# EAGLE design mainboard (EAGLE 6.5.0)
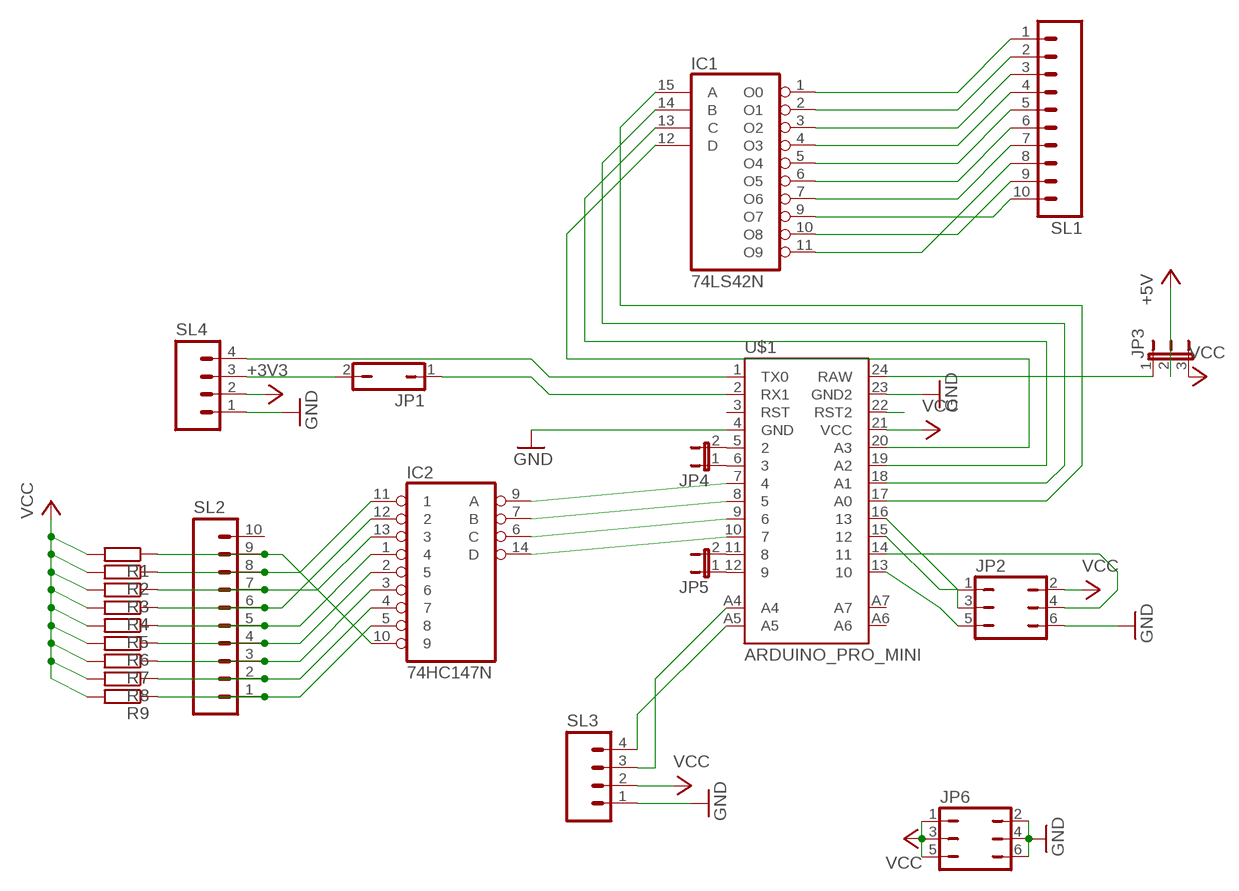
[diagram p0: schematic, sheet 1]

## Parts
IC1  74LS42N  [DIL16]
IC2  74HC147N  [DIL16]
JP1  JP1Q  [JP1]
JP2  JP3Q  [JP3Q]
JP3  JP2E  [JP2]
JP4  JP1E  [JP1]
JP5  JP1E  [JP1]
JP6  JP3Q  [JP3Q]
R1  R-EU_0204/7  [0204/7]
R2  R-EU_0204/7  [0204/7]
R3  R-EU_0204/7  [0204/7]
R4  R-EU_0204/7  [0204/7]
R5  R-EU_0204/7  [0204/7]
R6  R-EU_0204/7  [0204/7]
R7  R-EU_0204/7  [0204/7]
R8  R-EU_0204/7  [0204/7]
R9  R-EU_0204/7  [0204/7]
SL1  M10  [10P]
SL2  M10  [10P]
SL3  M04  [04P]
SL4  M04  [04P]
U$1  ARDUINO_PRO_MINI  [ARDUINO_PRO_MINI]

## Nets
+3V3: SL4.2
+5V: JP3.2
GND [Ground]: JP2.6 JP6.2 JP6.4 JP6.6 SL3.1 SL4.1 U$1.4(GND) U$1.23(GND2)
N$1: IC2.2 R6.1 SL2.4
N$2: IC2.1 R5.1 SL2.5
N$3: IC2.12 R4.1 SL2.6
N$4: IC2.5 R9.1 SL2.1
N$5: IC2.4 R8.1 SL2.2
N$6: IC2.3 R7.1 SL2.3
N$7: IC2.13 R3.1 SL2.7
N$8: IC2.11 R2.1 SL2.8
N$9: IC2.10 R1.1 SL2.9
N$10: IC1.15(A) U$1.17(A0)
N$11: IC1.14(B) U$1.18(A1)
N$12: IC1.13(C) U$1.19(A2)
N$13: IC1.12(D) U$1.20(A3)
N$14: IC1.9(O7) SL1.10
N$15: IC1.10(O8) SL1.9
N$16: IC1.11(O9) SL1.8
N$17: IC2.9(A) U$1.7
N$18: IC1.1(O0) SL1.1
N$19: IC1.2(O1) SL1.2
N$20: IC1.3(O2) SL1.3
N$21: IC1.4(O3) SL1.4
N$22: IC1.5(O4) SL1.5
N$23: IC1.6(O5) SL1.6
N$24: IC1.7(O6) SL1.7
N$25: IC2.7(B) U$1.8
N$26: IC2.6(C) U$1.9
N$27: IC2.14(D) U$1.10
N$28: SL3.4 U$1.A5
N$29: SL3.3 U$1.A4
N$30: SL4.4 U$1.1(TX0)
N$31: JP1.2 SL4.3
N$32: JP1.1 U$1.2(RX1)
N$33: JP2.1 U$1.15
N$34: JP2.3 U$1.16
N$35: JP2.5 U$1.13
N$36: JP2.4 U$1.14
N$41: JP3.1 U$1.24(RAW)
N$42: JP4.1 U$1.6
N$43: JP4.2 U$1.5
N$44: JP5.1 U$1.12
N$45: JP5.2 U$1.11
N$46: U$1.22(RST2)
VCC [Ground]: JP2.2 JP3.3 JP6.1 JP6.3 JP6.5 R1.2 R2.2 R3.2 R4.2 R5.2 R6.2 R7.2 R8.2 R9.2 SL3.2 U$1.21(VCC)
Unconnected: SL2.10 U$1.3(RST) U$1.A6 U$1.A7

## Power pins joined to a net without a drawn wire
GND: IC1.8(GND) IC2.8(GND)
VCC: IC1.16(VCC) IC2.16(VCC)

## Library data of the parts
IC1 = 74xx-eu:74*42: 4-line to 10-line DECODER (1-of-10)
IC2 = 74xx-eu:74*147: 10-line to 4-line and 8-line to 3-line PRIORITY DECODER
JP1 = jumper:JP1Q: JUMPER
JP2 JP6 = jumper:JP3Q: JUMPER
JP3 = jumper:JP2E: JUMPER
JP4 JP5 = jumper:JP1E: JUMPER
R1-R9 = resistor:R-EU_: RESISTOR, European symbol
SL1 SL2 = con-amp-quick:M10: AMP QUICK CONNECTOR; OC_FARNELL: unknown; OC_NEWARK: unknown
SL3 SL4 = con-amp-quick:M04: AMP QUICK CONNECTOR; OC_FARNELL: unknown; OC_NEWARK: unknown
U$1 = SparkFun-Boards:ARDUINO_PRO_MINI

## Net classes
0 default: width 3.759 mm, clearance 0.914 mm
1 Ground: width 1.219 mm, clearance 0.914 mm

## Board
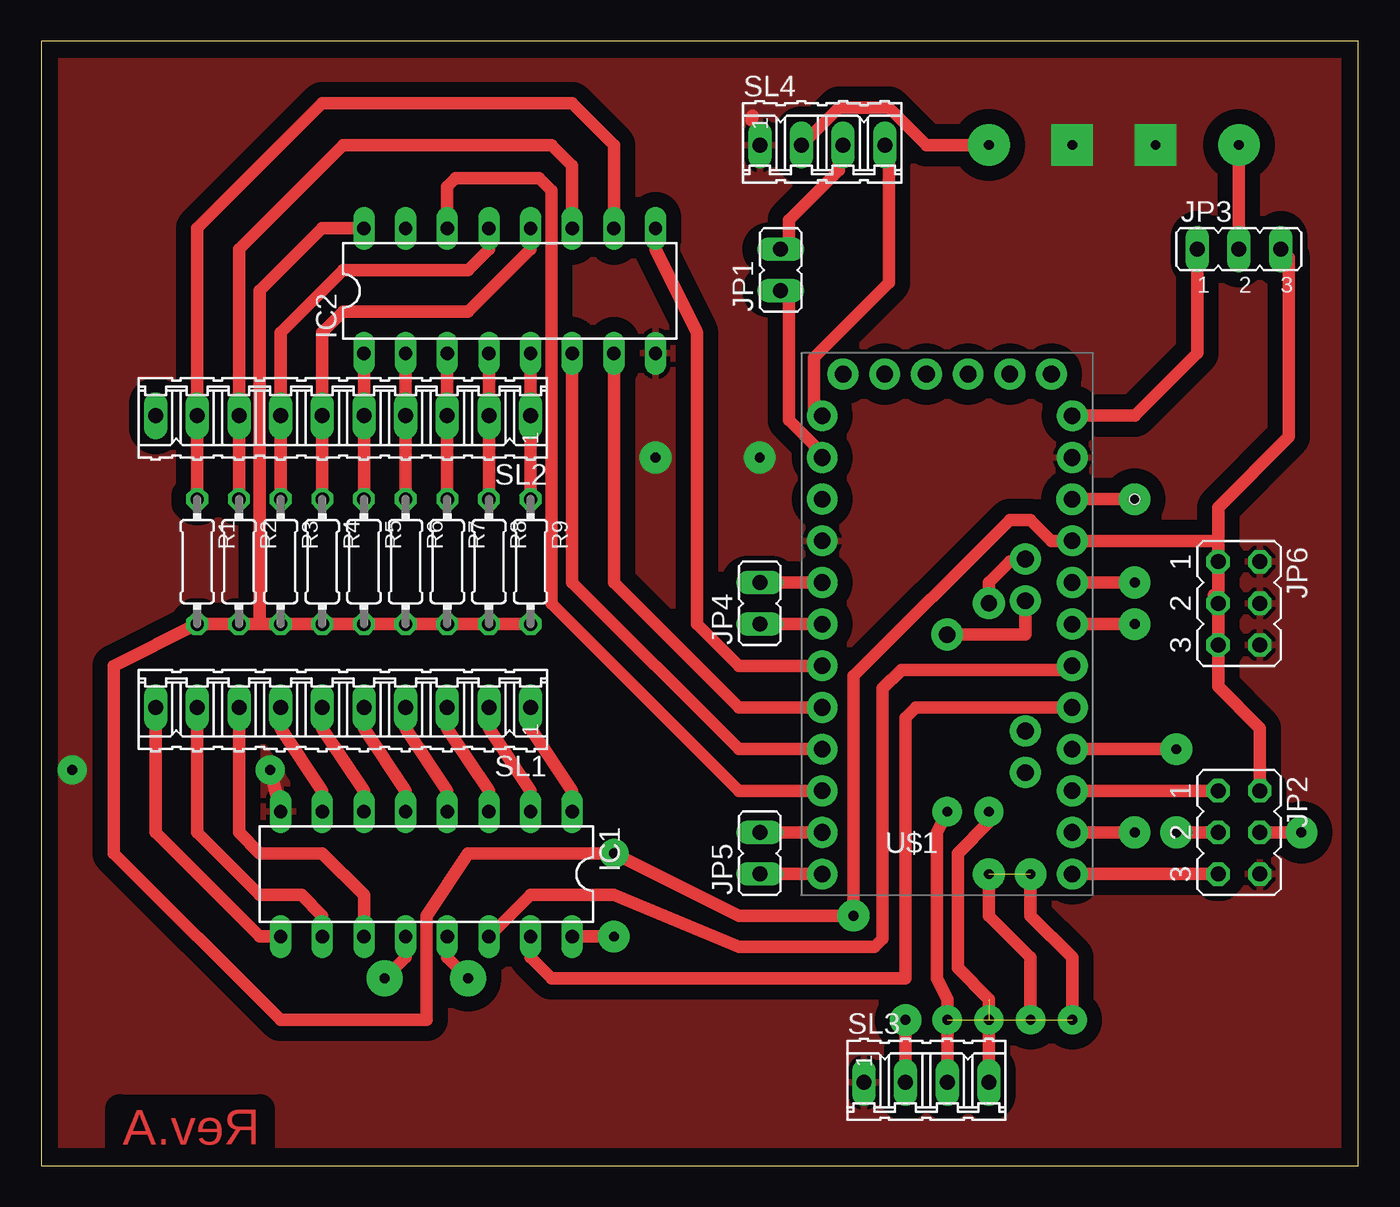
[diagram p1: board, top side]
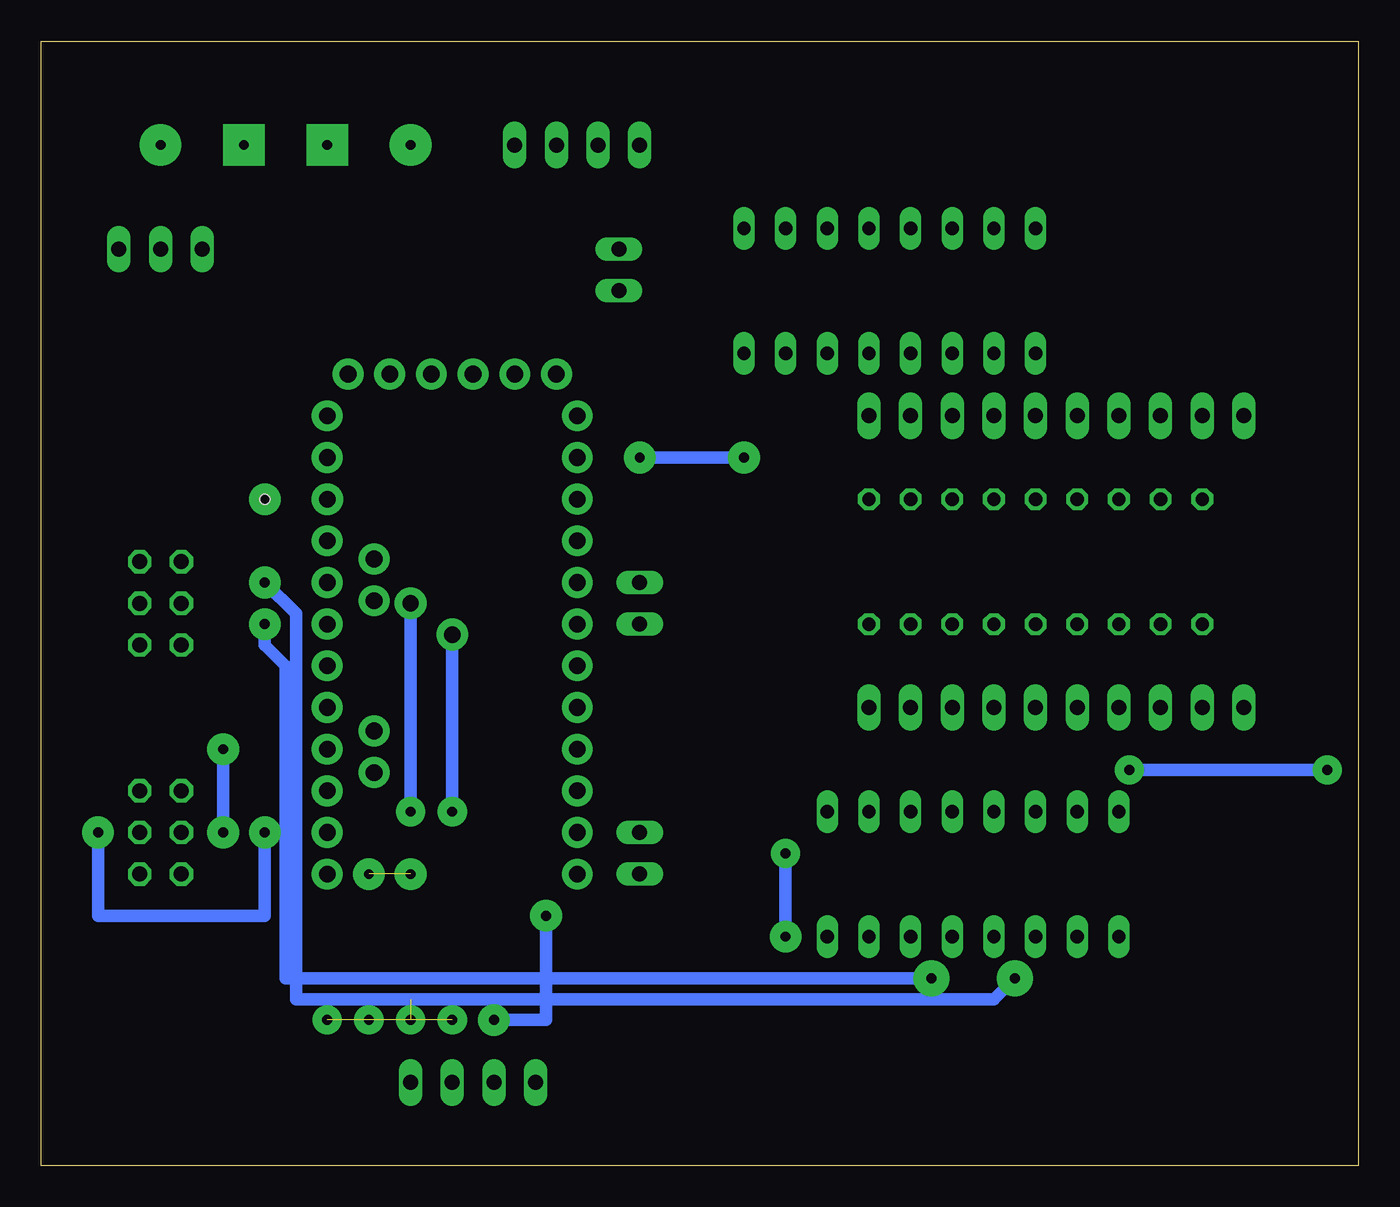
[diagram p2: board, bottom side, seen from below]

Size 80.31 x 68.57 mm. Coordinates in mm from the lower left corner, seen from the top.
Outline: 0,0 80.31,0 80.31,68.57 0,68.57 0,0
Copper layers (1*16): Top 0.035mm / dielectric 1.5mm / Bottom 0.035mm
Design rules "default": minimum track width 10mil, minimum drill 24mil, track to track 8mil, track to pad 8mil, pad to pad 8mil, via to via 8mil, smd to smd 8mil, copper to edge 40mil, drill to drill 8mil, minimum pad ring 10mil, minimum via ring 8mil, stop-mask expansion 4mil, vias tented up to drill 0mil, thermal gap 10mil
Holes 0.6 mm at 66.67,40.64

### Footprints (pad centres in the part's own frame; a part is rotated, then mirrored left to right if it is on the bottom)
DIL16 = drill 0.813 long: 1 -8.89,-3.81; 2 -6.35,-3.81; 3 -3.81,-3.81; 4 -1.27,-3.81; 5 1.27,-3.81; 6 3.81,-3.81; 7 6.35,-3.81; 8 8.89,-3.81; 9 8.89,3.81; 10 6.35,3.81; 11 3.81,3.81; 12 1.27,3.81; 13 -1.27,3.81; 14 -3.81,3.81; 15 -6.35,3.81; 16 -8.89,3.81
JP1 = drill 0.914 long: 1 0,-1.27; 2 0,1.27
JP3Q = drill 0.914 octagon: 1 -2.54,-1.27; 2 -2.54,1.27; 3 0,-1.27; 4 0,1.27; 5 2.54,-1.27; 6 2.54,1.27
JP2 = drill 0.914 long: 1 -2.54,0; 2 0,0; 3 2.54,0
0204/7 = drill 0.813 octagon: 1 -3.81,0; 2 3.81,0
10P = drill 0.914 long: 1 -11.43,0; 2 -8.89,0; 3 -6.35,0; 4 -3.81,0; 5 -1.27,0; 6 1.27,0; 7 3.81,0; 8 6.35,0; 9 8.89,0; 10 11.43,0
04P = drill 0.914 long: 1 -3.81,0; 2 -1.27,0; 3 1.27,0; 4 3.81,0
ARDUINO_PRO_MINI = drill 1.016 pad 1.88: 1 -7.62,12.7; 2 -7.62,10.16; 3 -7.62,7.62; 4 -7.62,5.08; 5 -7.62,2.54; 6 -7.62,0; 7 -7.62,-2.54; 8 -7.62,-5.08; 9 -7.62,-7.62; 10 -7.62,-10.16; 11 -7.62,-12.7; 12 -7.62,-15.24; 13 7.62,-15.24; 14 7.62,-12.7; 15 7.62,-10.16; 16 7.62,-7.62; 17 7.62,-5.08; 18 7.62,-2.54; 19 7.62,0; 20 7.62,2.54; 21 7.62,5.08; 22 7.62,7.62; 23 7.62,10.16; 24 7.62,12.7; A4 4.763,1.429; A5 4.763,3.969; A6 4.763,-9.049; A7 4.763,-6.509; BLK -6.35,15.24; GND -3.81,15.24; GRN 6.35,15.24; RXI 1.27,15.24; TXO 3.81,15.24; VCC -1.27,15.24

### Placement (x,y rotation side)
IC1  23.49,17.78 180 top
IC2  28.57,53.34 0 top
JP1  45.09,54.61 0 top
JP2  73.02,20.32 270 top
JP3  73.02,55.88 0 top
JP4  43.81,34.29 0 top
JP5  43.81,19.05 0 top
JP6  73.02,34.29 270 top
R1  9.53,36.83 270 top
R2  12.06,36.83 270 top
R3  14.6,36.83 270 top
R4  17.15,36.83 270 top
R5  19.69,36.83 270 top
R6  22.23,36.83 270 top
R7  24.77,36.83 270 top
R8  27.3,36.83 270 top
R9  29.84,36.83 270 top
SL1  18.41,27.94 180 top
SL2  18.41,45.72 180 top
SL3  53.97,5.08 0 top
SL4  47.62,62.23 0 top
U$1  55.25,33.02 0 top

### Tracks (layer width: path | path; a pad name or v marks a point on that pad's centre or on a via)
+3V3  (via drill 0.6 pad 2.54)
  Top 0.762: v57.78,62.23 53.97,62.23 51.69,64.52 48.64,64.52 SL4.2
+5V  (via drill 0.6 pad 2.54)
  Top 0.762: JP3.2 v73.02,62.23
GND  (via drill 0.6 pad 1.78, 0.6 pad 1.93, 0.6 pad 2.54)
  Top 0.762: IC1.8 v13.97,24.13 | 43.31,63.75 43.37,64.02
  Bottom 0.762: v13.97,24.13 v1.9,24.13 | v37.46,43.18 v43.81,43.18
  other vias: 62.86,62.23 67.94,62.23
  pour Top: 0,68.58 0,1.27 81.91,1.27 81.91,68.58
N$1
  Top 0.762: R6.1 SL2.4 IC2.2
N$2
  Top 0.762: R5.1 SL2.5 IC2.1
N$3
  Top 0.762: R4.1 SL2.6 17.15,50.8 18.41,52.07 26.03,52.07 29.84,55.88 IC2.12
N$4
  Top 0.762: R9.1 SL2.1 IC2.5
N$5
  Top 0.762: R8.1 SL2.2 IC2.4
N$6
  Top 0.762: R7.1 SL2.3 IC2.3
N$7
  Top 0.762: R3.1 SL2.7 14.6,50.8 18.41,54.61 26.03,54.61 27.3,55.88 IC2.13
N$8
  Top 0.762: R2.1 SL2.8 12.06,55.88 18.41,62.23 31.11,62.23 32.38,60.96 IC2.11
N$9
  Top 0.762: R1.1 SL2.9 9.53,57.15 17.15,64.77 32.38,64.77 34.92,62.23 IC2.10
N$10
  Top 0.762: IC1.15 29.84,12.7 31.11,11.43 52.7,11.43 52.7,27.3 53.34,27.94 U$1.17
N$11
  Top 0.762: IC1.14 29.84,16.51 34.92,16.51 42.55,13.33 50.8,13.33 51.31,13.84 51.31,29.08 52.45,30.23 62.36,30.23 U$1.18
N$12  (via drill 0.6, 0.6 pad 2.18)
  Top 0.762: IC1.13 24.77,12.7 v26.03,11.43 | v66.67,33.02 U$1.19
  Bottom 0.762: v26.03,11.43 65.41,11.43 65.41,30.48 66.67,31.75 v66.67,33.02
N$13  (via drill 0.6, 0.6 pad 1.93)
  Top 0.762: IC1.12 22.23,12.7 v20.95,11.43 | v66.67,35.56 U$1.20
  Bottom 0.762: v20.95,11.43 22.23,10.16 64.77,10.16 64.77,33.66 v66.67,35.56
N$14
  Top 0.762: SL1.10 6.99,20.32 13.33,13.97 IC1.9
N$15
  Top 0.762: SL1.9 9.53,20.32 13.33,16.51 15.88,16.51 17.15,15.24 IC1.10
N$16
  Top 0.762: SL1.8 12.06,20.32 13.33,19.05 17.15,19.05 19.69,16.51 IC1.11
N$17
  Top 0.762: IC2.9 37.46,55.88 40,50.8 40,33.02 42.55,30.48 U$1.7
N$18
  Top 0.762: SL1.1 29.84,26.67 32.38,22.86 IC1.1
N$19
  Top 0.762: SL1.2 27.3,26.67 29.84,22.86 IC1.2
N$20
  Top 0.762: SL1.3 24.77,26.67 27.3,22.86 IC1.3
N$21
  Top 0.762: SL1.4 22.23,26.67 24.77,22.86 IC1.4
N$22
  Top 0.762: SL1.5 19.69,26.67 22.23,22.86 IC1.5
N$23
  Top 0.762: SL1.6 17.15,26.67 19.69,22.86 IC1.6
N$24
  Top 0.762: SL1.7 14.6,26.67 17.15,22.86 IC1.7
N$25
  Top 0.762: IC2.7 34.92,35.56 42.55,27.94 U$1.8
N$26
  Top 0.762: IC2.6 32.38,35.56 42.55,25.4 U$1.9
N$27
  Top 0.762: IC2.14 24.77,59.69 25.27,60.2 30.35,60.2 31.11,59.44 31.11,34.29 42.55,22.86 U$1.10
N$28  (via drill 0.6 pad 1.78, 1 pad 1.93)  (4 unrouted)
  Top 0.762: v57.78,34.29 57.78,35.56 59.05,36.83 59.85,36.83 U$1.A5 | v57.78,21.59 57.78,20.95 55.88,19.05 55.88,12.06 57.78,10.16 SL3.4
  Bottom 0.762: v57.78,34.29 v57.78,21.59
  other vias: 60.33,8.89 62.86,8.89 57.78,8.89 60.33,8.89 55.25,8.89
N$29  (via drill 0.6 pad 1.78, 1 pad 1.93)
  Top 0.762: U$1.A4 60.01,32.38 v55.25,32.38 | v55.25,21.59 54.61,20.32 54.61,11.43 55.25,10.16 SL3.3
  Bottom 0.762: v55.25,32.38 v55.25,21.59
N$30
  Top 0.762: SL4.4 51.69,62.23 51.69,53.85 47.12,49.28 47.12,46.23 U$1.1
N$31
  Top 0.762: JP1.2 45.59,56.13 45.59,57.66 48.64,60.71 48.64,62.23 SL4.3
N$32
  Top 0.762: JP1.1 45.59,53.09 45.59,45.47 47.88,43.18 U$1.2
N$33
  Top 0.762: U$1.15 JP2.1
N$34  (via drill 0.6 pad 1.93)
  Top 0.762: U$1.16 v69.22,25.4 | v69.22,20.32 JP2.3
  Bottom 0.762: v69.22,25.4 v69.22,20.32
N$35
  Top 0.762: U$1.13 JP2.5
N$36  (via drill 0.6 pad 1.93)
  Top 0.762: U$1.14 v66.67,20.32 | v76.83,20.32 JP2.4
  Bottom 0.762: v66.67,20.32 66.67,15.24 76.83,15.24 v76.83,20.32
N$38  (via drill 0.6 pad 2.18)
  other vias: 20.95,11.43
N$39  (via drill 0.6 pad 1.93)
  other vias: 66.67,33.02
N$40  (via drill 0.6 pad 1.93)  (1 unrouted)
  Top 0.762: v57.78,17.78 57.78,15.24 60.33,12.7 60.33,8.89 | v60.33,17.78 60.33,15.24 62.86,12.7 62.86,8.89
N$41
  Top 0.762: JP3.1 70.48,49.53 66.67,45.72 U$1.24
N$42
  Top 0.762: U$1.6 JP4.1
N$43
  Top 0.762: JP4.2 U$1.5
N$44
  Top 0.762: U$1.12 JP5.1
N$45
  Top 0.762: JP5.2 U$1.11
N$47  (via drill 0.6 pad 1.93)
  Top 0.762: v66.67,40.64 v62.86,40.64
VCC  (via drill 0.6 pad 1.78, 0.6 pad 1.93)
  Top 0.762: R1.2 R2.2 13.33,33.02 | 13.33,33.02 R3.2 R4.2 R5.2 R6.2 R7.2 R8.2 R9.2 R1.2 | 13.33,33.02 13.33,53.34 17.15,57.15 IC2.16 | IC1.16 v34.92,13.97 | R1.2 4.45,30.48 4.45,19.05 14.6,8.89 23.49,8.89 23.49,15.24 26.03,19.05 v34.92,19.05 42.55,15.24 v49.53,15.24 49.53,29.84 59.05,39.37 60.33,39.37 61.59,38.1 U$1.21 71.75,38.1 | JP3.3 76.07,55.37 76.07,44.45 71.75,40.13 71.75,38.1 | JP2.2 74.3,26.67 71.75,29.21 JP6.5 | JP6.5 JP6.3 | JP6.3 71.75,34.8 | 71.75,34.8 JP6.1 | JP6.1 71.75,37.08 | 71.75,37.08 71.75,38.1 | 71.5,31.75 JP6.5 | 71.75,34.8 71.5,34.8 JP6.3 | JP6.1 71.5,37.08 71.75,37.08 | SL3.2 v52.7,8.89
  Bottom 0.762: v34.92,13.97 v34.92,19.05 | v52.7,8.89 49.53,8.89 v49.53,15.24

### Text on the board
Top: Rev.A